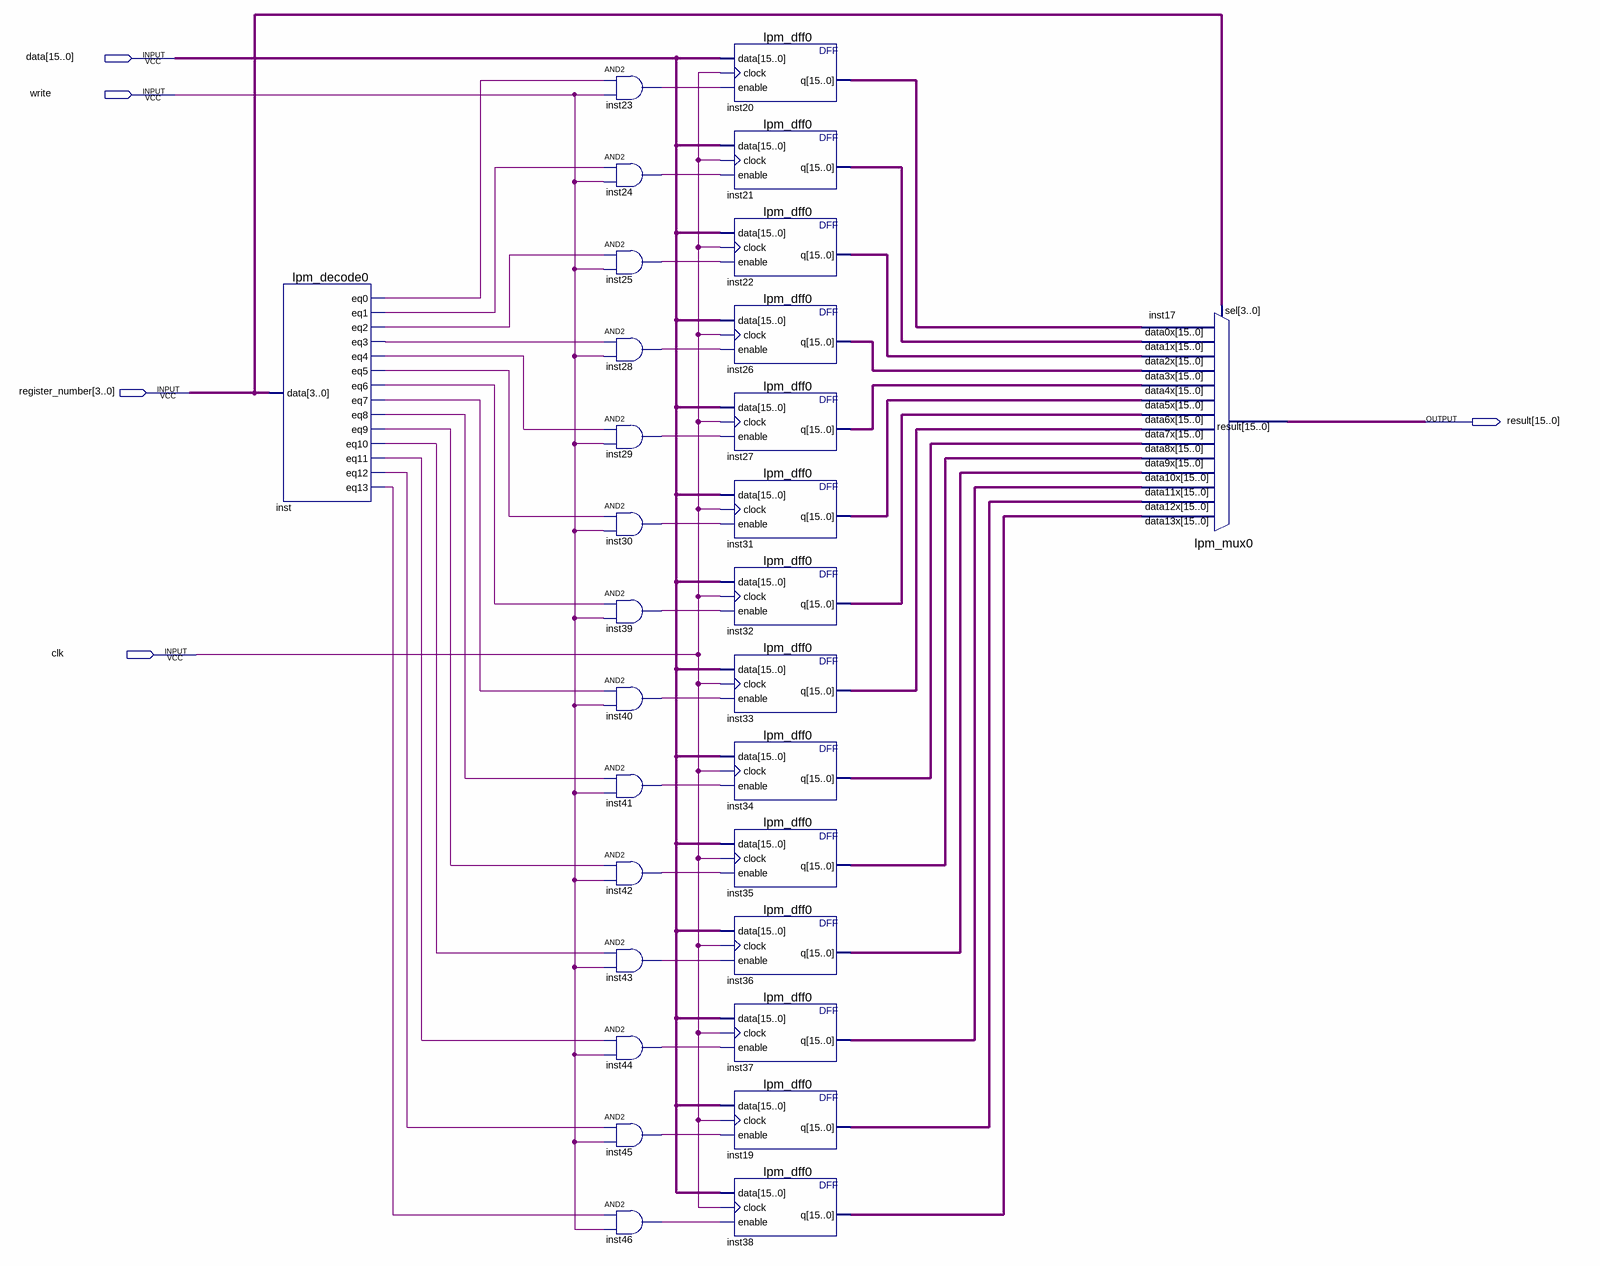
[diagram p0: schematic sheet]
// Quartus schematic RON.bdf as structural Verilog: 30 symbols, 5 pins
module RON (
  input  [15:0] data,
  input  write,
  input  [3:0] register_number,
  input  clk,
  output [15:0] result
);

  wire inst23_out, inst24_out, inst25_out, inst28_out, inst29_out, inst30_out, inst39_out, inst40_out,
       inst41_out, inst42_out, inst43_out, inst44_out, inst45_out, inst46_out, inst_eq0, inst_eq1, inst_eq2,
       inst_eq3, inst_eq4, inst_eq5, inst_eq6, inst_eq7, inst_eq8, inst_eq9, inst_eq10, inst_eq11, inst_eq12,
       inst_eq13;
  wire [15:0] inst19_q, inst20_q, inst21_q, inst22_q, inst26_q, inst27_q, inst31_q, inst32_q, inst33_q,
       inst34_q, inst35_q, inst36_q, inst37_q, inst38_q;

  lpm_decode0 inst (
    .data(register_number), .eq0(inst_eq0), .eq1(inst_eq1), .eq2(inst_eq2), .eq3(inst_eq3), .eq4(inst_eq4),
    .eq5(inst_eq5), .eq6(inst_eq6), .eq7(inst_eq7), .eq8(inst_eq8), .eq9(inst_eq9), .eq10(inst_eq10),
    .eq11(inst_eq11), .eq12(inst_eq12), .eq13(inst_eq13));
  and inst23 (inst23_out, inst_eq0, write);
  and inst24 (inst24_out, inst_eq1, write);
  and inst25 (inst25_out, inst_eq2, write);
  and inst28 (inst28_out, inst_eq3, write);
  and inst29 (inst29_out, inst_eq4, write);
  and inst30 (inst30_out, inst_eq5, write);
  and inst39 (inst39_out, inst_eq6, write);
  and inst40 (inst40_out, inst_eq7, write);
  and inst41 (inst41_out, inst_eq8, write);
  and inst42 (inst42_out, inst_eq9, write);
  and inst43 (inst43_out, inst_eq10, write);
  and inst44 (inst44_out, inst_eq11, write);
  and inst45 (inst45_out, inst_eq12, write);
  and inst46 (inst46_out, inst_eq13, write);
  lpm_dff0 inst20 (.data(data), .clock(clk), .enable(inst23_out), .q(inst20_q));
  lpm_dff0 inst21 (.data(data), .clock(clk), .enable(inst24_out), .q(inst21_q));
  lpm_dff0 inst22 (.data(data), .clock(clk), .enable(inst25_out), .q(inst22_q));
  lpm_dff0 inst26 (.data(data), .clock(clk), .enable(inst28_out), .q(inst26_q));
  lpm_dff0 inst27 (.data(data), .clock(clk), .enable(inst29_out), .q(inst27_q));
  lpm_dff0 inst31 (.data(data), .clock(clk), .enable(inst30_out), .q(inst31_q));
  lpm_dff0 inst32 (.data(data), .clock(clk), .enable(inst39_out), .q(inst32_q));
  lpm_dff0 inst33 (.data(data), .clock(clk), .enable(inst40_out), .q(inst33_q));
  lpm_dff0 inst34 (.data(data), .clock(clk), .enable(inst41_out), .q(inst34_q));
  lpm_dff0 inst35 (.data(data), .clock(clk), .enable(inst42_out), .q(inst35_q));
  lpm_dff0 inst36 (.data(data), .clock(clk), .enable(inst43_out), .q(inst36_q));
  lpm_dff0 inst37 (.data(data), .clock(clk), .enable(inst44_out), .q(inst37_q));
  lpm_dff0 inst19 (.data(data), .clock(clk), .enable(inst45_out), .q(inst19_q));
  lpm_dff0 inst38 (.data(data), .clock(clk), .enable(inst46_out), .q(inst38_q));
  lpm_mux0 inst17 (
    .data13x(inst38_q), .data12x(inst19_q), .data11x(inst37_q), .data10x(inst36_q), .data9x(inst35_q),
    .data8x(inst34_q), .data7x(inst33_q), .data6x(inst32_q), .data5x(inst31_q), .data4x(inst27_q),
    .data3x(inst26_q), .data2x(inst22_q), .data1x(inst21_q), .data0x(inst20_q), .sel(register_number),
    .result(result));
endmodule
